# EAGLE schematic M7104B (EAGLE 6.6.0)

## Sheet 1 of 5
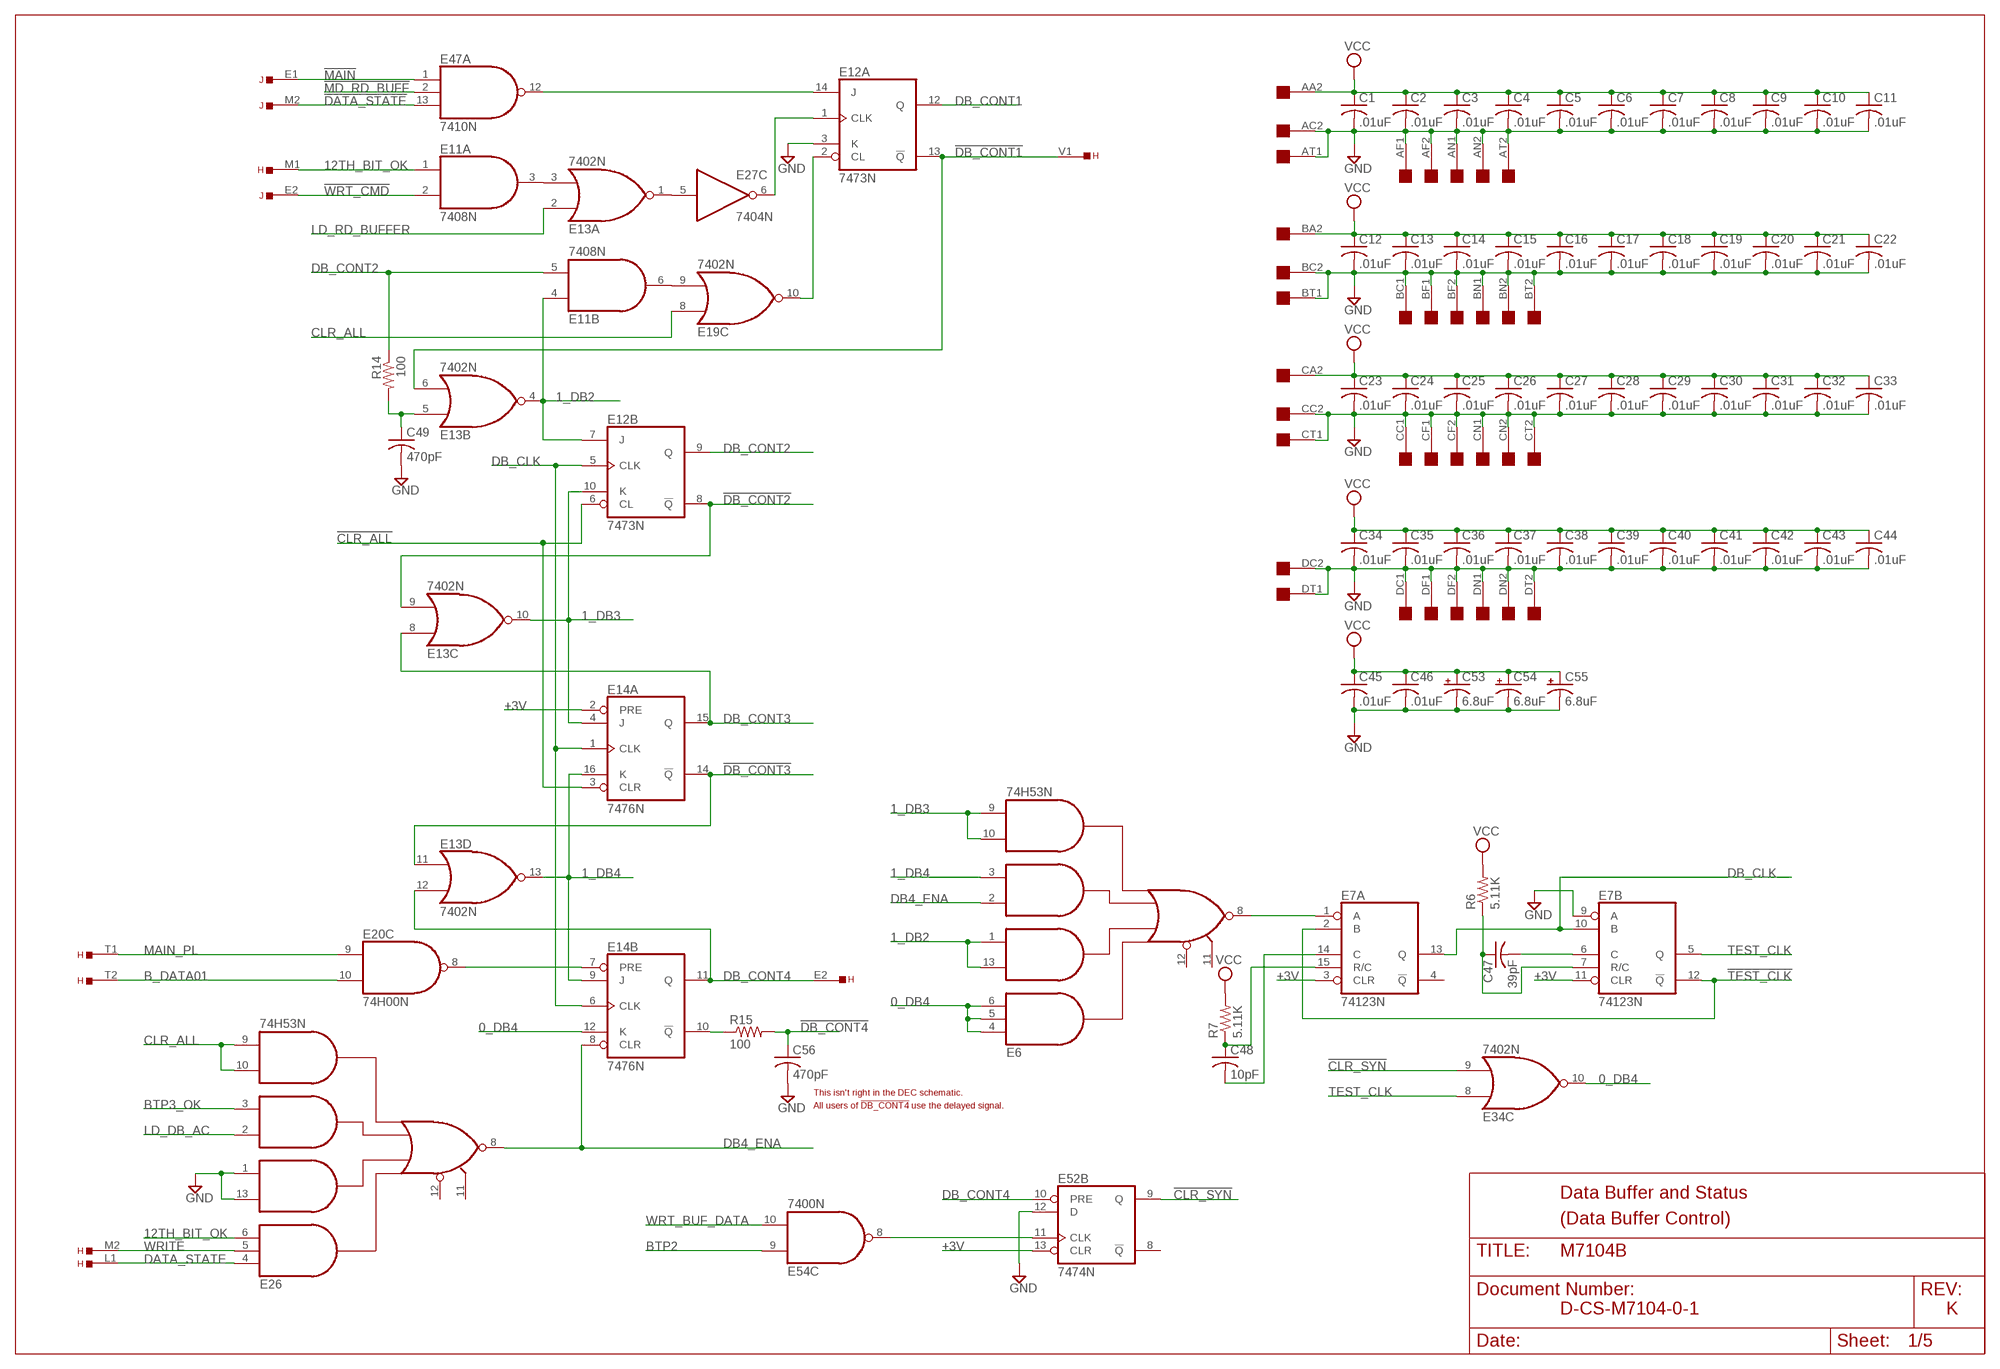
[diagram p0: schematic, sheet 1]

### Parts
C1  .01uF  C-US  [C063-025X075]
C2  .01uF  C-US  [C063-025X075]
C3  .01uF  C-US  [C063-025X075]
C4  .01uF  C-US  [C063-025X075]
C5  .01uF  C-US  [C063-025X075]
C6  .01uF  C-US  [C063-025X075]
C7  .01uF  C-US  [C063-025X075]
C8  .01uF  C-US  [C063-025X075]
C9  .01uF  C-US  [C063-025X075]
C10  .01uF  C-US  [C063-025X075]
C11  .01uF  C-US  [C063-025X075]
C12  .01uF  C-US  [C063-025X075]
C13  .01uF  C-US  [C063-025X075]
C14  .01uF  C-US  [C063-025X075]
C15  .01uF  C-US  [C063-025X075]
C16  .01uF  C-US  [C063-025X075]
C17  .01uF  C-US  [C063-025X075]
C18  .01uF  C-US  [C063-025X075]
C19  .01uF  C-US  [C063-025X075]
C20  .01uF  C-US  [C063-025X075]
C21  .01uF  C-US  [C063-025X075]
C22  .01uF  C-US  [C063-025X075]
C23  .01uF  C-US  [C063-025X075]
C24  .01uF  C-US  [C063-025X075]
C25  .01uF  C-US  [C063-025X075]
C26  .01uF  C-US  [C063-025X075]
C27  .01uF  C-US  [C063-025X075]
C28  .01uF  C-US  [C063-025X075]
C29  .01uF  C-US  [C063-025X075]
C30  .01uF  C-US  [C063-025X075]
C31  .01uF  C-US  [C063-025X075]
C32  .01uF  C-US  [C063-025X075]
C33  .01uF  C-US  [C063-025X075]
C34  .01uF  C-US  [C063-025X075]
C35  .01uF  C-US  [C063-025X075]
C36  .01uF  C-US  [C063-025X075]
C37  .01uF  C-US  [C063-025X075]
C38  .01uF  C-US  [C063-025X075]
C39  .01uF  C-US  [C063-025X075]
C40  .01uF  C-US  [C063-025X075]
C41  .01uF  C-US  [C063-025X075]
C42  .01uF  C-US  [C063-025X075]
C43  .01uF  C-US  [C063-025X075]
C44  .01uF  C-US  [C063-025X075]
C45  .01uF  C-US  [C063-025X075]
C46  .01uF  C-US  [C063-025X075]
C47  39pF  C-US  [C063-025X075]
C48  10pF  C-US  [C063-025X075]
C49  470pF  C-US  [C063-025X075]
C53  6.8uF  CPOL-USE20-8AXIAL  [E12-8]
C54  6.8uF  CPOL-USE20-8AXIAL  [E12-8]
C55  6.8uF  CPOL-USE20-8AXIAL  [E12-8]
C56  470pF  C-US  [C063-025X075]
E6  74H53N  [DIL14]
E7  74123N  [DIL16]
E11  7408N  74S08N  [DIL14]
E12  7473N  74LS73N  [DIL14]
E13  7402N  [DIL14]
E14  7476N  [DIL16]
E19  7402N  [DIL14]
E20  74H00N  74S00N  [DIL14]
E26  74H53N  [DIL14]
E27  7404N  [DIL14]
E34  7402N  [DIL14]
E47  7410N  [DIL14]
E52  7474N  74S74N  [DIL14]
E54  7400N  [DIL14]
H  EDGE-TOP  [EDGE-CON2]
J  EDGE-TOP  [EDGE-CON2]
OMNIBUS  QUAD  [EDGE-CON8]
R6  5.11K  R-US_0207/15  [0207/15]
R7  5.11K  R-US_0207/15  [0207/15]
R14  100  R-US_0207/10  [0207/10]
R15  100  R-US_0207/10  [0207/10]

### Nets
0_DB4: E6.4(I1) E6.5(I11) E6.6(I2) E14.12(B:K) E34.10(C:O)
1_DB2: E6.1(I4) E6.13(I3) E11.4(B:I0) E12.7(B:J) E13.4(B:O)
1_DB3: E6.9(I8) E6.10(I7) E12.10(B:K) E13.10(C:O) E14.4(A:J)
1_DB4: E6.3(I6) E13.13(D:O) E14.9(B:J) E14.16(A:K) ; also sheet 2
12TH_BIT_OK: E11.1(A:I0) E26.6(I2) H.M1
!CLR_ALL: E12.6(B:CL) E14.3(A:CLR) ; also sheet 4
!CLR_SYN: E34.9(C:I1) E52.9(B:Q)
!DATA_STATE: E47.13(A:I2) J.M2
!DB_CONT1: E12.13(A:!Q) E13.6(B:I1) H.V1
!DB_CONT2: E12.8(B:!Q) E13.9(C:I1) ; also sheet 3
!DB_CONT3: E13.11(D:I0) E14.14(A:!Q)
!DB_CONT4: C56.1 R15.2 ; also sheet 2,5
!MAIN: E47.1(A:I0) J.E1 ; also sheet 5
!MD_RD_BUFF: E47.2(A:I1) ; also sheet 2,4
!TEST_CLK: E7.2(A:B) E7.12(B:!Q)
!WRT_CMD: E11.2(A:I1) J.E2 ; also sheet 2,5
+3V: E7.3(A:CLR) E7.11(B:CLR) E14.2(A:PRE) E52.13(B:CLR) ; also sheet 2,3,4,5
B_DATA01: E20.10(C:I1) H.T2
BTP2: E54.9(C:I0) ; also sheet 4
BTP3_OK: E26.3(I6) ; also sheet 4,5
CLR_ALL: E19.8(C:I0) E26.9(I8) E26.10(I7) ; also sheet 3,4,5
DATA_STATE: E26.4(I1) H.L1
DB4_ENA: E6.2(I5) E14.8(B:CLR) E26.8(O)
DB_CLK: E7.10(B:B) E7.13(A:Q) E12.5(B:CLK) E14.1(A:CLK) E14.6(B:CLK) ; also sheet 2
DB_CONT1: E12.12(A:Q) ; also sheet 5
DB_CONT2: E11.5(B:I1) E12.9(B:Q) R14.1 ; also sheet 2
DB_CONT3: E13.8(C:I0) E14.15(A:Q) ; also sheet 2,3
DB_CONT4: E13.12(D:I1) E14.11(B:Q) E52.10(B:PRE) H.E2
GND [supply]: C1.2 C2.2 C3.2 C4.2 C5.2 C6.2 C7.2 C8.2 C9.2 C10.2 C11.2 C12.2 C13.2 C14.2 C15.2 C16.2 C17.2 C18.2 C19.2 C20.2 C21.2 C22.2 C23.2 C24.2 C25.2 C26.2 C27.2 C28.2 C29.2 C30.2 C31.2 C32.2 C33.2 C34.2 C35.2 C36.2 C37.2 C38.2 C39.2 C40.2 C41.2 C42.2 C43.2 C44.2 C45.2 C46.2 C49.2 C53.- C54.- C55.- C56.2 E7.9(B:A) E12.3(A:K) E26.1(I4) E26.13(I3) E52.12(B:D) OMNIBUS.AC2 OMNIBUS.AF1 OMNIBUS.AF2 OMNIBUS.AN1 OMNIBUS.AN2 OMNIBUS.AT1 OMNIBUS.AT2 OMNIBUS.BC1 OMNIBUS.BC2 OMNIBUS.BF1 OMNIBUS.BF2 OMNIBUS.BN1 OMNIBUS.BN2 OMNIBUS.BT1 OMNIBUS.BT2 OMNIBUS.CC1 OMNIBUS.CC2 OMNIBUS.CF1 OMNIBUS.CF2 OMNIBUS.CN1 OMNIBUS.CN2 OMNIBUS.CT1 OMNIBUS.CT2 OMNIBUS.DC1 OMNIBUS.DC2 OMNIBUS.DF1 OMNIBUS.DF2 OMNIBUS.DN1 OMNIBUS.DN2 OMNIBUS.DT1 OMNIBUS.DT2 ; also sheet 3,4,5
LD_DB_AC: E26.2(I5) ; also sheet 4
LD_RD_BUFFER: E13.2(A:I0) ; also sheet 2
MAIN_PL: E20.9(C:I0) H.T1
N$1: E14.10(B:!Q) R15.1
N$7: E12.14(A:J) E47.12(A:O)
N$8: C48.1 E7.15(A:R/C) R7.1
N$13: E11.3(A:O) E13.3(A:I1)
N$14: E13.1(A:O) E27.5(C:I)
N$15: E12.1(A:CLK) E27.6(C:O)
N$16: E11.6(B:O) E19.9(C:I1)
N$17: E12.2(A:CL) E19.10(C:O)
N$19: E52.11(B:CLK) E54.8(C:O)
N$20: C49.1 E13.5(B:I0) R14.2
N$22: E6.8(O) E7.1(A:A)
N$24: C47.1 E7.7(B:R/C) R6.1
N$25: C47.2 E7.6(B:C)
N$27: C48.2 E7.14(A:C)
N$34: E14.7(B:PRE) E20.8(C:O)
TEST_CLK: E7.5(B:Q) E34.8(C:I0)
VCC [supply]: C1.1 C2.1 C3.1 C4.1 C5.1 C6.1 C7.1 C8.1 C9.1 C10.1 C11.1 C12.1 C13.1 C14.1 C15.1 C16.1 C17.1 C18.1 C19.1 C20.1 C21.1 C22.1 C23.1 C24.1 C25.1 C26.1 C27.1 C28.1 C29.1 C30.1 C31.1 C32.1 C33.1 C34.1 C35.1 C36.1 C37.1 C38.1 C39.1 C40.1 C41.1 C42.1 C43.1 C44.1 C45.1 C46.1 C53.+ C54.+ C55.+ OMNIBUS.AA2 OMNIBUS.BA2 OMNIBUS.CA2 R6.2 R7.2 ; also sheet 4,5
WRITE: E26.5(I11) H.M2
WRT_BUF_DATA: E54.10(C:I1) ; also sheet 3
Unconnected: E6.11(I10) E6.12(I9) E7.4(A:!Q) E26.11(I10) E26.12(I9) E52.8(B:!Q) H.F2 H.H2 H.J2 H.K2 J.T2 J.V1 J.V2 OMNIBUS.AA1 OMNIBUS.AB1 OMNIBUS.AB2 OMNIBUS.AC1 OMNIBUS.AD1 OMNIBUS.AD2 OMNIBUS.AE1 OMNIBUS.AE2 OMNIBUS.AH1 OMNIBUS.AH2 OMNIBUS.AJ1 OMNIBUS.AJ2 OMNIBUS.AK2 OMNIBUS.AL2 OMNIBUS.AM2 OMNIBUS.AP2 OMNIBUS.AR2 OMNIBUS.AS2 OMNIBUS.AU2 OMNIBUS.AV2 OMNIBUS.BA1 OMNIBUS.BB1 OMNIBUS.BB2 OMNIBUS.BD1 OMNIBUS.BD2 OMNIBUS.BE1 OMNIBUS.BE2 OMNIBUS.BH1 OMNIBUS.BH2 OMNIBUS.BJ1 OMNIBUS.BJ2 OMNIBUS.BK2 OMNIBUS.BL2 OMNIBUS.BM2 OMNIBUS.BP2 OMNIBUS.BR2 OMNIBUS.BS2 OMNIBUS.BU2 OMNIBUS.CA1 OMNIBUS.CB1 OMNIBUS.CB2 OMNIBUS.CJ1 OMNIBUS.CJ2 OMNIBUS.CK1 OMNIBUS.CK2 OMNIBUS.CL2 OMNIBUS.CM1 OMNIBUS.CP2 OMNIBUS.CR2 OMNIBUS.CS2 OMNIBUS.CU1 OMNIBUS.CU2 OMNIBUS.CV1 OMNIBUS.CV2 OMNIBUS.DA1 OMNIBUS.DA2 OMNIBUS.DB1 OMNIBUS.DB2 OMNIBUS.DD1 OMNIBUS.DD2 OMNIBUS.DE1 OMNIBUS.DE2 OMNIBUS.DH1 OMNIBUS.DH2 OMNIBUS.DJ1 OMNIBUS.DJ2 OMNIBUS.DK2 OMNIBUS.DL2 OMNIBUS.DM2 OMNIBUS.DP2 OMNIBUS.DR2 OMNIBUS.DS2 OMNIBUS.DU2 OMNIBUS.DV2

### Notes on the sheet
- This isn't right in the DEC schematic.
- All users of !DB_CONT4! use the delayed signal.
- Data Buffer and Status
- (Data Buffer Control)
- D-CS-M7104-0-1 | K

## Sheet 2 of 5
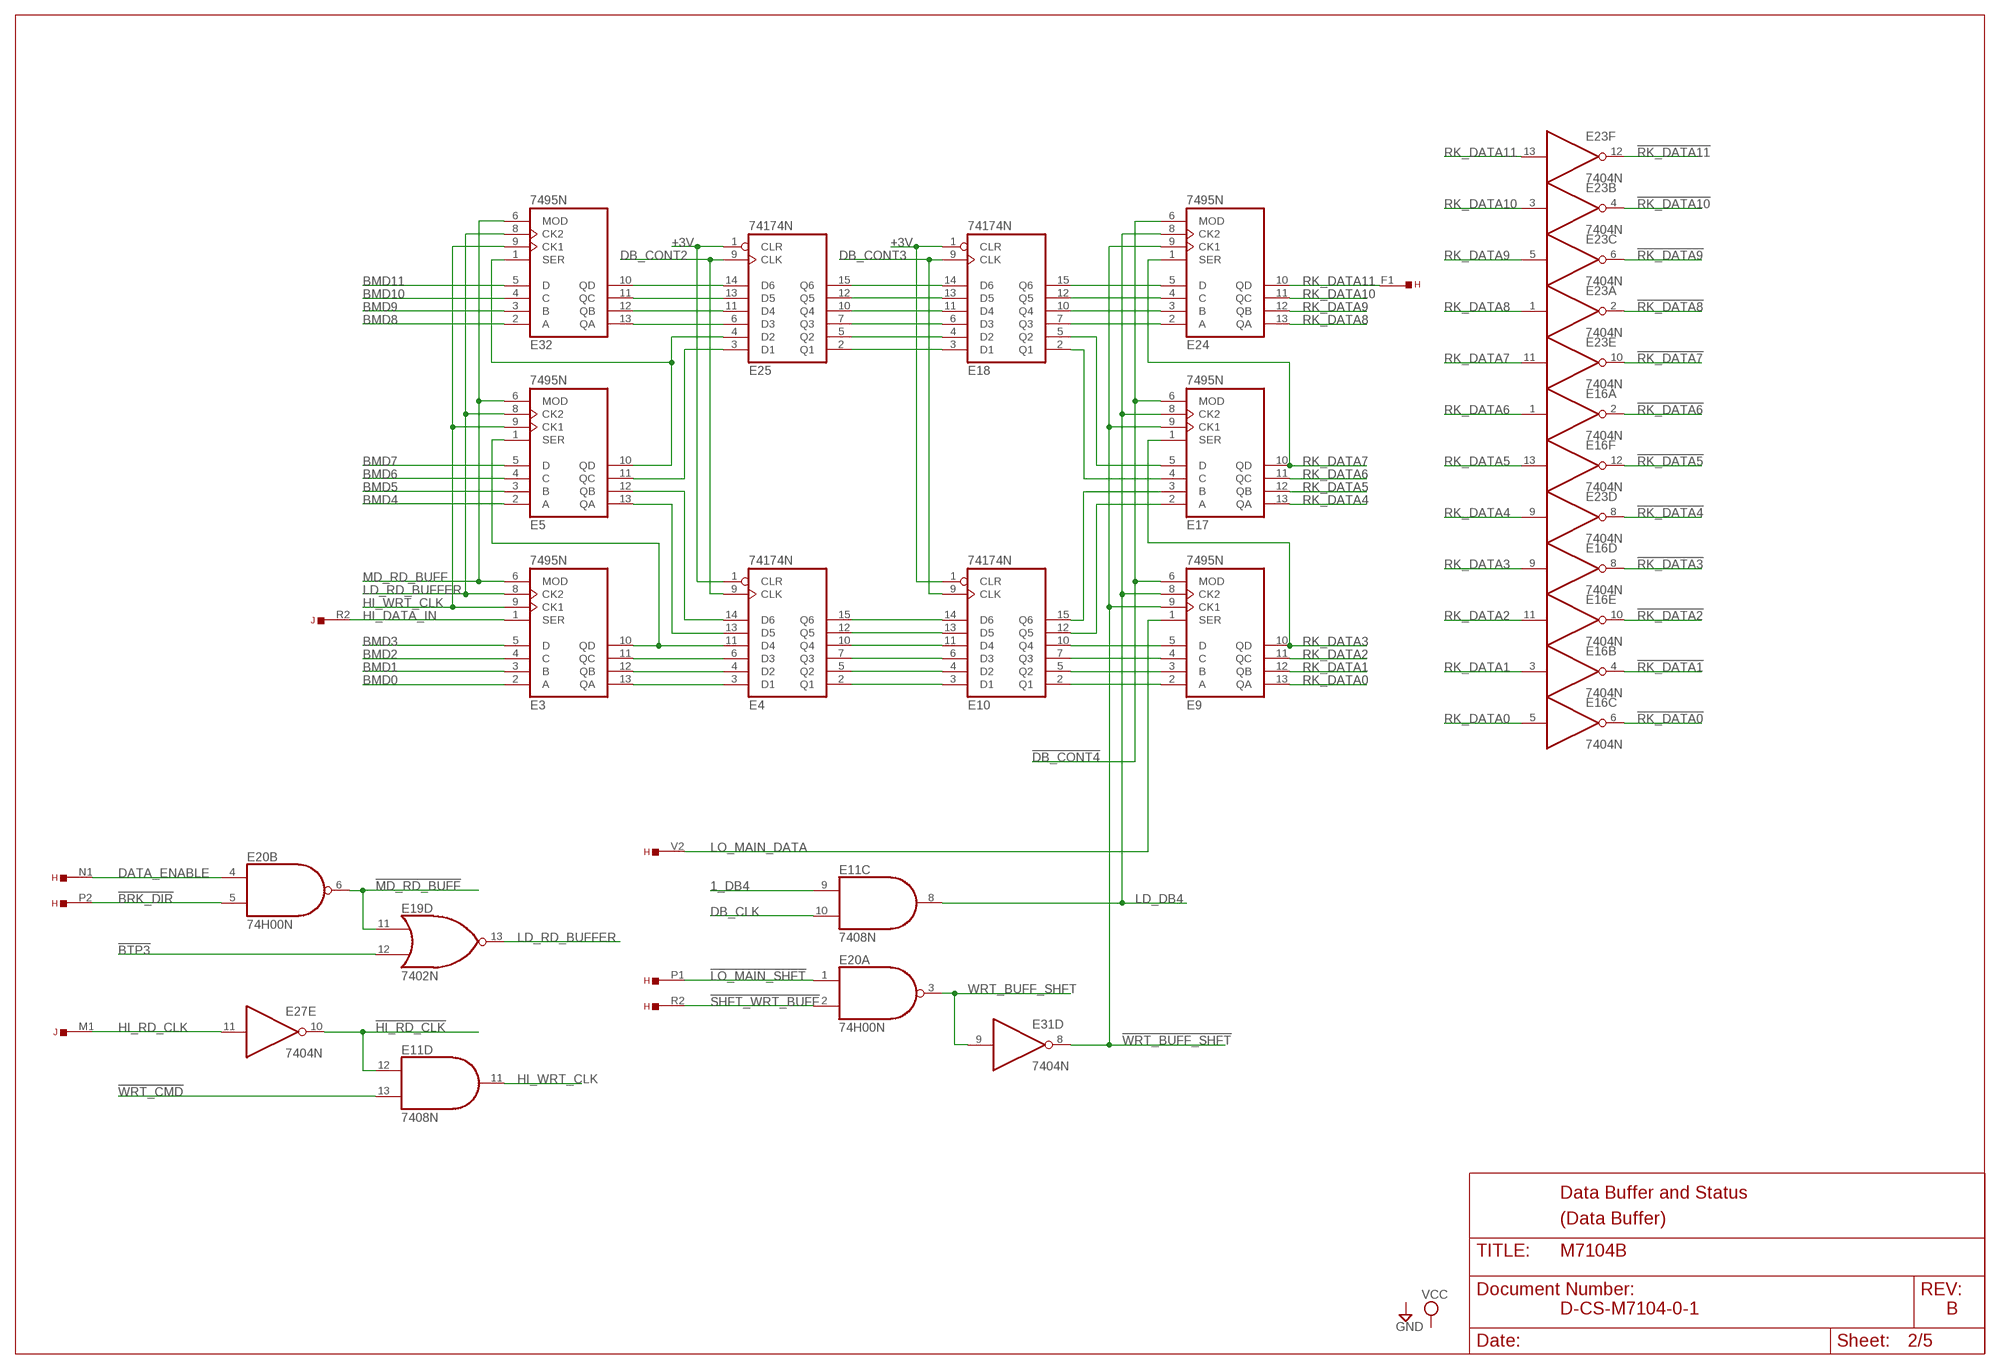
[diagram p1: schematic, sheet 2]

### Parts
E3  7495N  [DIL14]
E4  74174N  [DIL16]
E5  7495N  [DIL14]
E9  7495N  [DIL14]
E10  74174N  [DIL16]
E16  7404N  [DIL14]
E17  7495N  [DIL14]
E18  74174N  [DIL16]
E23  7404N  [DIL14]
E24  7495N  [DIL14]
E25  74174N  [DIL16]
E31  7404N  [DIL14]
E32  7495N  [DIL14]

### Nets
1_DB4: E11.9(C:I0) ; also sheet 1
!BRK_DIR: E20.5(B:I1) H.P2
!BTP3: E19.12(D:I1) ; also sheet 4
!DB_CONT4: E9.6(MOD) E17.6(MOD) E24.6(MOD) ; also sheet 1,5
!HI_RD_CLK: E11.12(D:I0) E27.10(E:O)
!LO_MAIN_SHFT: E20.1(A:I0) H.P1
!MD_RD_BUFF: E19.11(D:I0) E20.6(B:O) ; also sheet 1,4
!RK_DATA0: E16.6(C:O) ; also sheet 3
!RK_DATA1: E16.4(B:O) ; also sheet 3
!RK_DATA2: E16.10(E:O) ; also sheet 3
!RK_DATA3: E16.8(D:O) ; also sheet 3
!RK_DATA4: E23.8(D:O) ; also sheet 3
!RK_DATA5: E16.12(F:O) ; also sheet 3
!RK_DATA6: E16.2(A:O) ; also sheet 3
!RK_DATA7: E23.10(E:O) ; also sheet 3
!RK_DATA8: E23.2(A:O) ; also sheet 3
!RK_DATA9: E23.6(C:O) ; also sheet 3
!RK_DATA10: E23.4(B:O) ; also sheet 3
!RK_DATA11: E23.12(F:O) ; also sheet 3
!SHFT_WRT_BUFF: E20.2(A:I1) H.R2
!WRT_BUFF_SHFT: E9.9(CK1) E17.9(CK1) E24.9(CK1) E31.8(D:O)
!WRT_CMD: E11.13(D:I1) ; also sheet 1,5
+3V: E4.1(CLR) E10.1(CLR) E18.1(CLR) E25.1(CLR) ; also sheet 1,3,4,5
BMD0: E3.2(A) ; also sheet 4
BMD1: E3.3(B) ; also sheet 4
BMD2: E3.4(C) ; also sheet 4
BMD3: E3.5(D) ; also sheet 4
BMD4: E5.2(A) ; also sheet 4
BMD5: E5.3(B) ; also sheet 4
BMD6: E5.4(C) ; also sheet 4
BMD7: E5.5(D) ; also sheet 4
BMD8: E32.2(A) ; also sheet 4
BMD9: E32.3(B) ; also sheet 4
BMD10: E32.4(C) ; also sheet 4
BMD11: E32.5(D) ; also sheet 4
DATA_ENABLE: E20.4(B:I0) H.N1
DB_CLK: E11.10(C:I1) ; also sheet 1
DB_CONT2: E4.9(CLK) E25.9(CLK) ; also sheet 1
DB_CONT3: E10.9(CLK) E18.9(CLK) ; also sheet 1,3
HI_DATA_IN: E3.1(SER) J.R2
HI_RD_CLK: E27.11(E:I) J.M1 ; also sheet 5
HI_WRT_CLK: E3.9(CK1) E5.9(CK1) E11.11(D:O) E32.9(CK1)
LD_DB4: E9.8(CK2) E11.8(C:O) E17.8(CK2) E24.8(CK2)
LD_RD_BUFFER: E3.8(CK2) E5.8(CK2) E19.13(D:O) E32.8(CK2) ; also sheet 1
LO_MAIN_DATA: E9.1(SER) H.V2
MD_RD_BUFF: E3.6(MOD) E5.6(MOD) E32.6(MOD) ; also sheet 4
N$18: E3.13(QA) E4.3(D1)
N$23: E3.12(QB) E4.4(D2)
N$26: E3.11(QC) E4.6(D3)
N$28: E3.10(QD) E4.11(D4) E5.1(SER)
N$30: E25.13(D5) E32.11(QC)
N$31: E25.11(D4) E32.12(QB)
N$32: E25.6(D3) E32.13(QA)
N$36: E17.4(C) E18.2(Q1)
N$37: E5.11(QC) E25.3(D1)
N$38: E5.10(QD) E25.4(D2) E32.1(SER)
N$39: E17.5(D) E18.5(Q2)
N$40: E10.15(Q6) E17.3(B)
N$44: E18.7(Q3) E24.2(A)
N$45: E4.2(Q1) E10.3(D1)
N$46: E4.5(Q2) E10.4(D2)
N$47: E4.7(Q3) E10.6(D3)
N$48: E4.10(Q4) E10.11(D4)
N$49: E4.12(Q5) E10.13(D5)
N$50: E4.15(Q6) E10.14(D6)
N$51: E18.3(D1) E25.2(Q1)
N$52: E18.4(D2) E25.5(Q2)
N$53: E18.6(D3) E25.7(Q3)
N$54: E18.11(D4) E25.10(Q4)
N$55: E18.13(D5) E25.12(Q5)
N$56: E18.14(D6) E25.15(Q6)
N$57: E18.10(Q4) E24.3(B)
N$58: E18.12(Q5) E24.4(C)
N$59: E18.15(Q6) E24.5(D)
N$60: E10.12(Q5) E17.2(A)
N$61: E9.5(D) E10.10(Q4)
N$62: E4.14(D6) E5.12(QB)
N$63: E4.13(D5) E5.13(QA)
N$64: E25.14(D6) E32.10(QD)
N$65: E9.4(C) E10.7(Q3)
N$66: E9.3(B) E10.5(Q2)
N$67: E9.2(A) E10.2(Q1)
RK_DATA0: E9.13(QA) E16.5(C:I)
RK_DATA1: E9.12(QB) E16.3(B:I)
RK_DATA2: E9.11(QC) E16.11(E:I)
RK_DATA3: E9.10(QD) E16.9(D:I) E17.1(SER)
RK_DATA4: E17.13(QA) E23.9(D:I)
RK_DATA5: E16.13(F:I) E17.12(QB)
RK_DATA6: E16.1(A:I) E17.11(QC)
RK_DATA7: E17.10(QD) E23.11(E:I) E24.1(SER)
RK_DATA8: E23.1(A:I) E24.13(QA)
RK_DATA9: E23.5(C:I) E24.12(QB)
RK_DATA10: E23.3(B:I) E24.11(QC)
RK_DATA11: E23.13(F:I) E24.10(QD) H.F1
WRT_BUFF_SHFT: E20.3(A:O) E31.9(D:I)

### Notes on the sheet
- Data Buffer and Status
- (Data Buffer)
- D-CS-M7104-0-1 | B

## Sheet 3 of 5
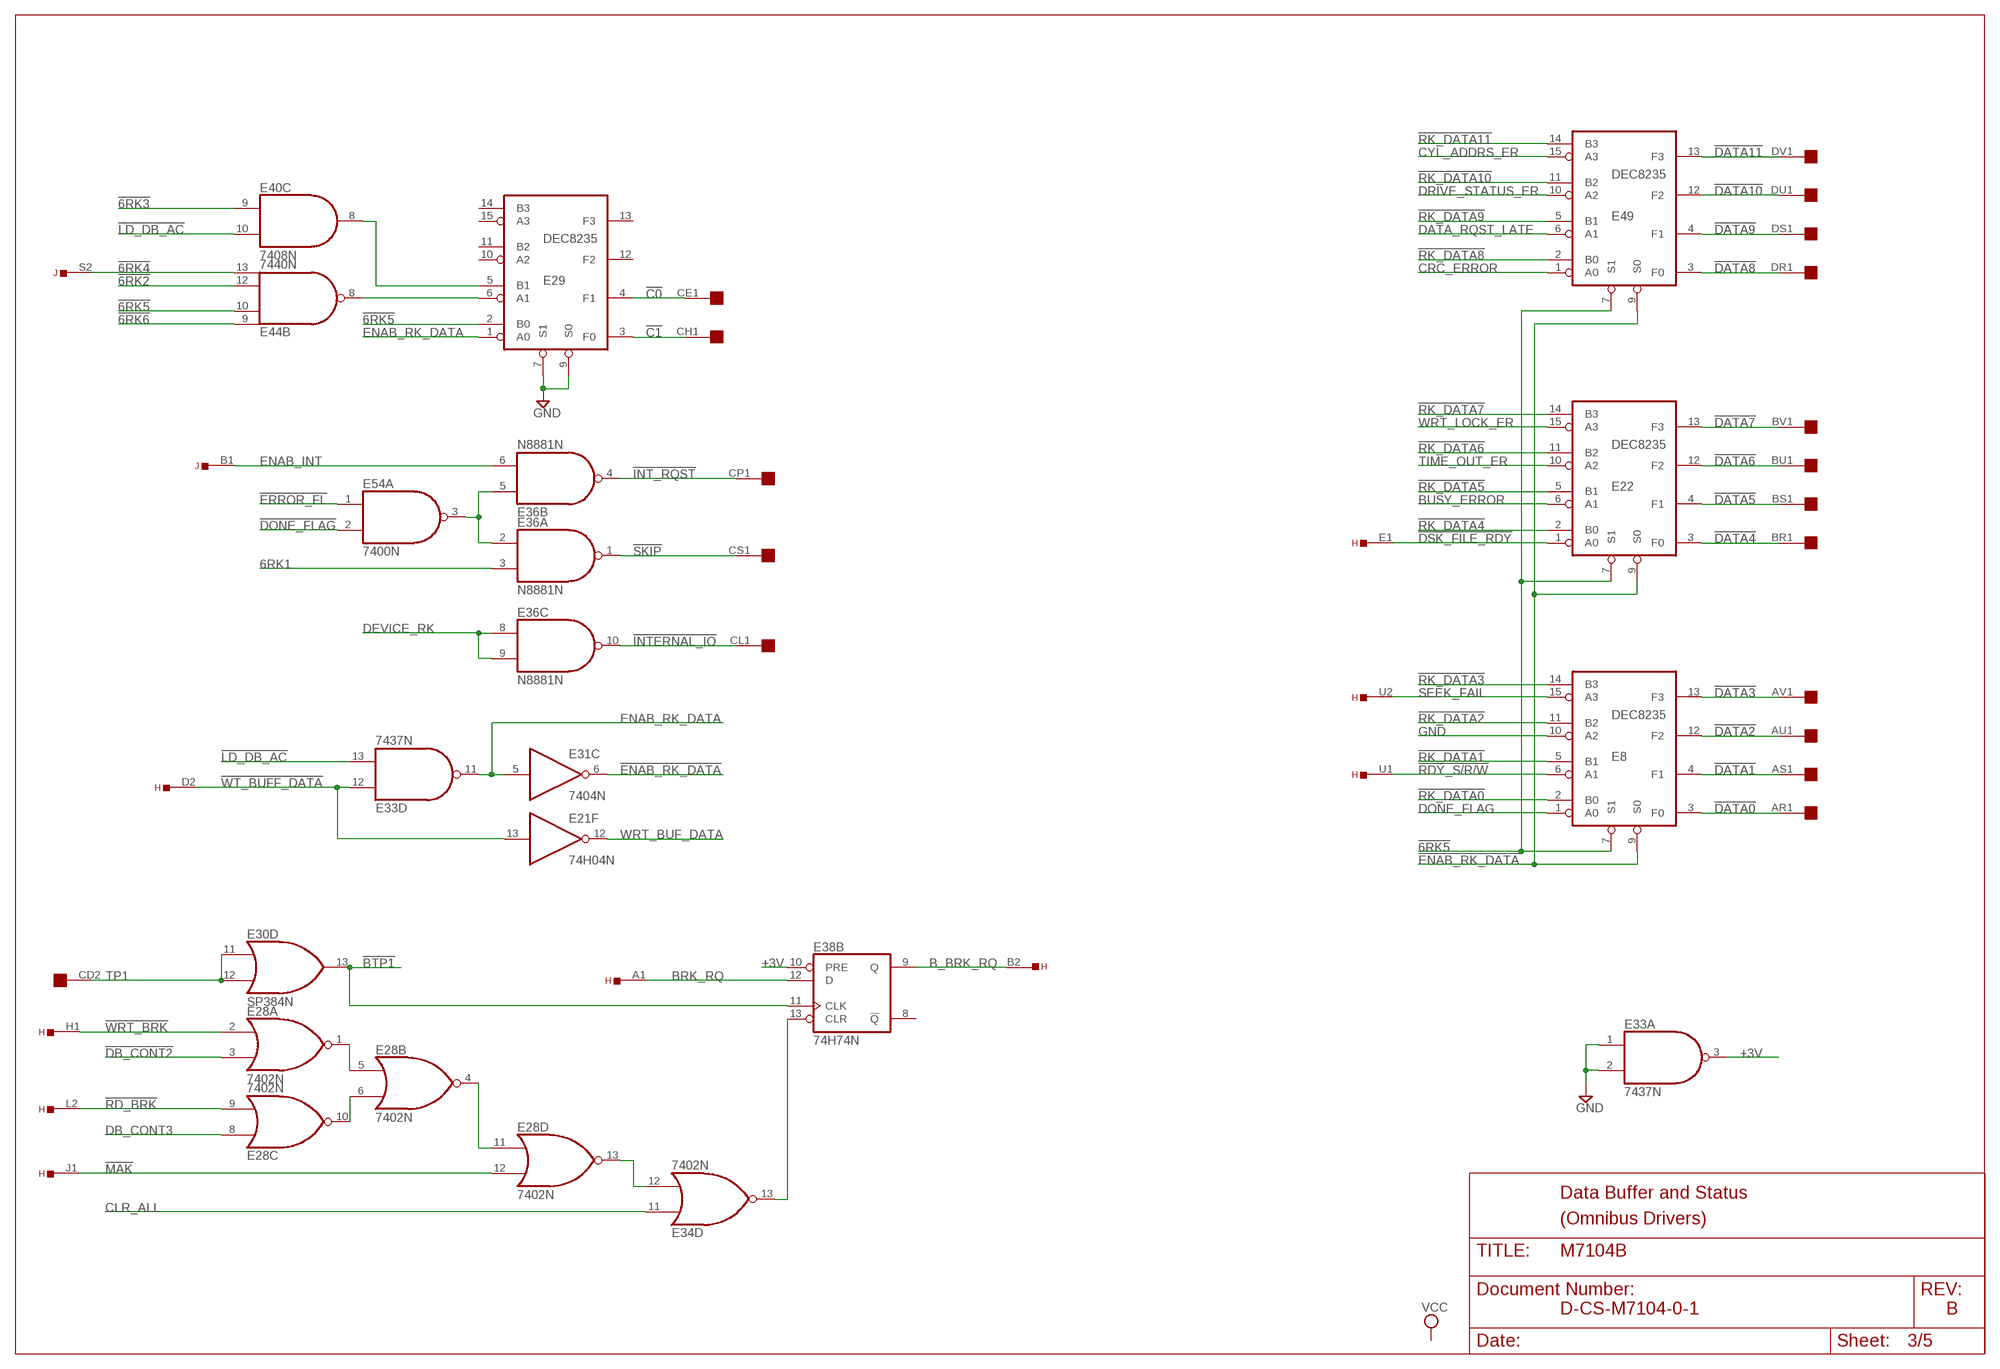
[diagram p2: schematic, sheet 3]

### Parts
E8  DEC8235  [DIL16]
E21  74H04N  7404N  [DIL14]
E22  DEC8235  [DIL16]
E28  7402N  [DIL14]
E29  DEC8235  [DIL16]
E30  SP384N  [DIL14]
E33  7437N  [DIL14]
E36  N8881N  [DIL14]
E38  74H74N  74S74N  [DIL14]
E40  7408N  74S08N  [DIL14]
E44  7440N  [DIL14]
E49  DEC8235  [DIL16]

### Nets
6RK1: E36.3(A:I1) ; also sheet 4
!6RK2: E44.12(B:I2) ; also sheet 4,5
!6RK3: E40.9(C:I0) ; also sheet 4,5
!6RK4: E44.13(B:I3) J.S2 ; also sheet 4,5
!6RK5: E8.7(S1) E22.7(S1) E29.2(B0) E44.10(B:I1) E49.7(S1) ; also sheet 4
!6RK6: E44.9(B:I0) ; also sheet 4,5
!BTP1: E30.13(D:O) E38.11(B:CLK)
!C0: E29.4(F1) OMNIBUS.CE1
!C1: E29.3(F0) OMNIBUS.CH1
!DATA0: E8.3(F0) OMNIBUS.AR1
!DATA1: E8.4(F1) OMNIBUS.AS1
!DATA2: E8.12(F2) OMNIBUS.AU1
!DATA3: E8.13(F3) OMNIBUS.AV1
!DATA4: E22.3(F0) OMNIBUS.BR1
!DATA5: E22.4(F1) OMNIBUS.BS1
!DATA6: E22.12(F2) OMNIBUS.BU1
!DATA7: E22.13(F3) OMNIBUS.BV1 ; also sheet 4
!DATA8: E49.3(F0) OMNIBUS.DR1
!DATA9: E49.4(F1) OMNIBUS.DS1
!DATA10: E49.12(F2) OMNIBUS.DU1
!DATA11: E49.13(F3) OMNIBUS.DV1
!DB_CONT2: E28.3(A:I1) ; also sheet 1
!DONE_FLAG: E54.2(A:I1) ; also sheet 5
!DSK_FILE_RDY: E22.1(A0) H.E1
!ENAB_RK_DATA: E8.9(S0) E22.9(S0) E31.6(C:O) E49.9(S0)
!ERROR_FL: E54.1(A:I0) ; also sheet 5
!INT_RQST: E36.4(B:O) OMNIBUS.CP1
!INTERNAL_IO: E36.10(C:O) OMNIBUS.CL1
!LD_DB_AC: E33.13(D:I1) E40.10(C:I1) ; also sheet 4
!MAK: E28.12(D:I1) H.J1
!RD_BRK: E28.9(C:I1) H.L2
!RDY_S/R/W: E8.6(A1) H.U1
!RK_DATA0: E8.2(B0) ; also sheet 2
!RK_DATA1: E8.5(B1) ; also sheet 2
!RK_DATA2: E8.11(B2) ; also sheet 2
!RK_DATA3: E8.14(B3) ; also sheet 2
!RK_DATA4: E22.2(B0) ; also sheet 2
!RK_DATA5: E22.5(B1) ; also sheet 2
!RK_DATA6: E22.11(B2) ; also sheet 2
!RK_DATA7: E22.14(B3) ; also sheet 2
!RK_DATA8: E49.2(B0) ; also sheet 2
!RK_DATA9: E49.5(B1) ; also sheet 2
!RK_DATA10: E49.11(B2) ; also sheet 2
!RK_DATA11: E49.14(B3) ; also sheet 2
!SKIP: E36.1(A:O) OMNIBUS.CS1
!WRT_BRK: E28.2(A:I0) H.H1
!WT_BUFF_DATA: E21.13(F:I) E33.12(D:I0) H.D2
+3V: E33.3(A:O) E38.10(B:PRE) ; also sheet 1,2,4,5
B_BRK_RQ: E38.9(B:Q) H.B2
BRK_RQ: E38.12(B:D) H.A1
BUSY_ERROR: E22.6(A1) ; also sheet 5
CLR_ALL: E34.11(D:I0) ; also sheet 1,4,5
CRC_ERROR: E49.1(A0) ; also sheet 5
CYL_ADDRS_ER: E49.15(A3) ; also sheet 5
DATA_RQST_LATE: E49.6(A1) ; also sheet 5
DB_CONT3: E28.8(C:I0) ; also sheet 1,2
DEVICE_RK: E36.8(C:I0) E36.9(C:I1) ; also sheet 4
DONE_FLAG: E8.1(A0) ; also sheet 5
DRIVE_STATUS_ER: E49.10(A2) ; also sheet 5
ENAB_INT: E36.6(B:I1) J.B1
ENAB_RK_DATA: E29.1(A0) E31.5(C:I) E33.11(D:O)
GND [supply]: E8.10(A2) E29.7(S1) E29.9(S0) E33.1(A:I0) E33.2(A:I1) ; also sheet 1,4,5
N$3: E29.6(A1) E44.8(B:O)
N$35: E29.5(B1) E40.8(C:O)
N$41: E36.2(A:I0) E36.5(B:I0) E54.3(A:O)
N$42: E28.1(A:O) E28.5(B:I0)
N$43: E28.6(B:I1) E28.10(C:O)
N$68: E28.4(B:O) E28.11(D:I0)
N$70: E34.13(D:O) E38.13(B:CLR)
N$72: E28.13(D:O) E34.12(D:I1)
SEEK_FAIL: E8.15(A3) H.U2
TIME_OUT_ER: E22.10(A2) ; also sheet 5
TP1: E30.11(D:I0) E30.12(D:I1) OMNIBUS.CD2
WRT_BUF_DATA: E21.12(F:O) ; also sheet 1
WRT_LOCK_ER: E22.15(A3) ; also sheet 5
Unconnected: E29.10(A2) E29.11(B2) E29.12(F2) E29.13(F3) E29.14(B3) E29.15(A3) E36.11(D:I0) E36.12(D:I1) E36.13(D:O) E38.8(B:!Q) E44.3(3:NC) E44.11(11:NC)

### Notes on the sheet
- Data Buffer and Status
- (Omnibus Drivers)
- D-CS-M7104-0-1 | B

## Sheet 4 of 5
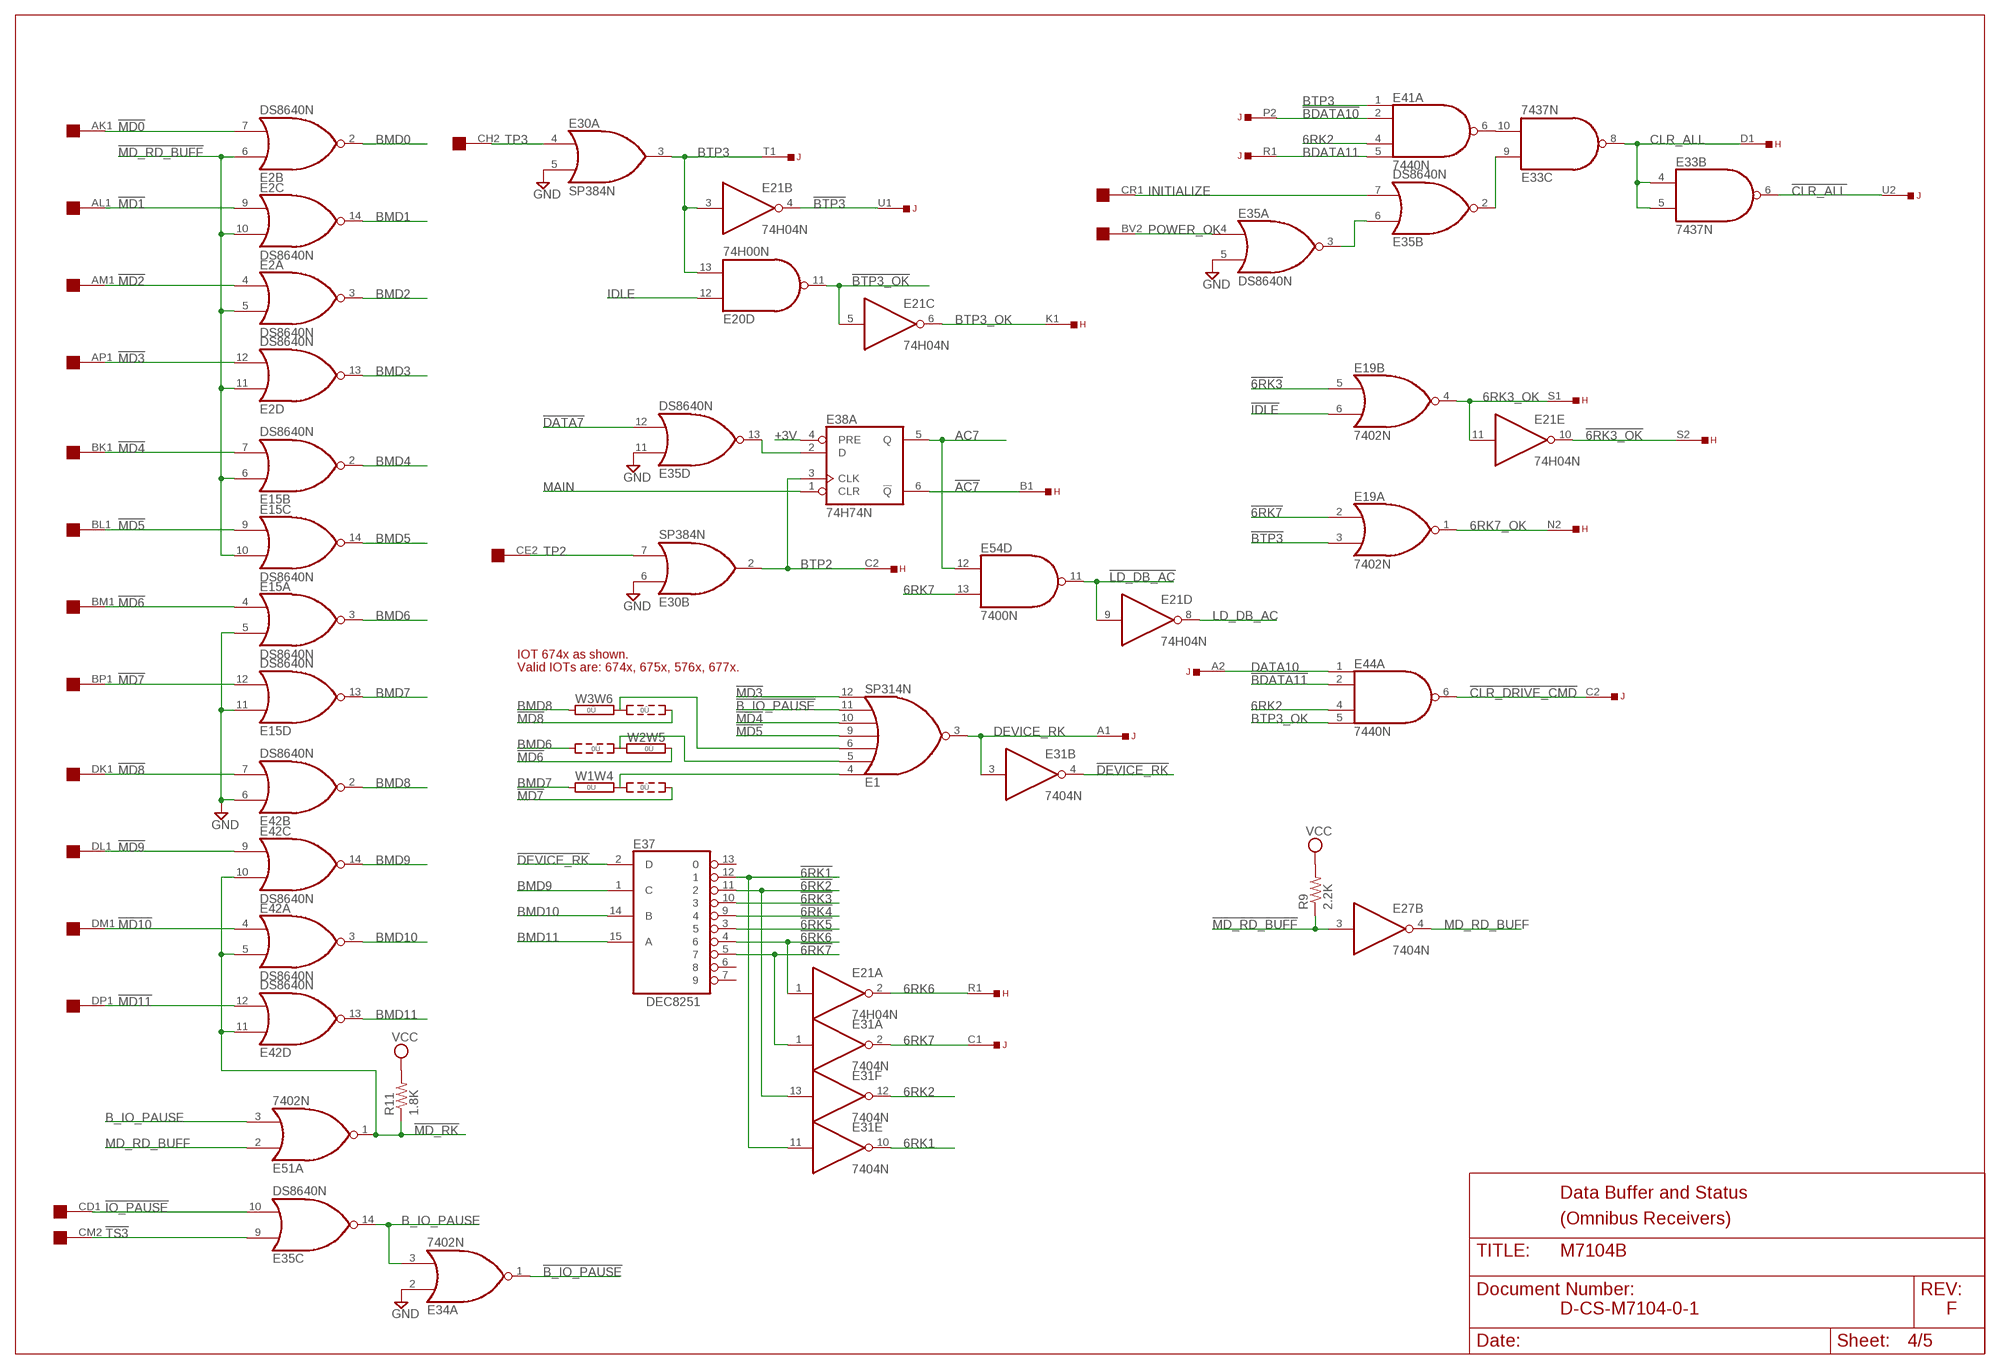
[diagram p3: schematic, sheet 4]

### Parts
E1  SP314N  [DIL14]
E2  DS8640N  [DIL14]
E15  DS8640N  [DIL14]
E35  DS8640N  [DIL14]
E37  DEC8251  [DIL16]
E41  7440N  [DIL14]
E42  DS8640N  [DIL14]
E51  7402N  [DIL14]
R9  2.2K  R-US_0207/10  [0207/10]
R11  1.8K  R-US_0207/10  [0207/10]
W1W4  0R2  [0R2/10]
W2W5  0R2  [0R2/10]
W3W6  0R2  [0R2/10]

### Nets
6RK1: E31.10(E:O) ; also sheet 3
6RK2: E31.12(F:O) E41.4(A:I2) E44.4(A:I2) ; also sheet 5
6RK3_OK: E19.4(B:O) E21.11(E:I) H.S1
6RK6: E21.2(A:O) H.R1
6RK7: E31.2(A:O) E54.13(D:I1) J.C1
6RK7_OK: E19.1(A:O) H.N2
!6RK1: E31.11(E:I) E37.12
!6RK2: E31.13(F:I) E37.11 ; also sheet 3,5
!6RK3: E19.5(B:I0) E37.10 ; also sheet 3,5
!6RK3_OK: E21.10(E:O) H.S2
!6RK4: E37.9 ; also sheet 3,5
!6RK5: E37.3 ; also sheet 3
!6RK6: E21.1(A:I) E37.4 ; also sheet 3,5
!6RK7: E19.2(A:I0) E31.1(A:I) E37.5
!AC7: E38.6(A:!Q) H.B1
!B_IO_PAUSE: E1.11(I5) E34.1(A:O)
!BDATA10: E41.2(A:I1) J.P2
!BDATA11: E44.2(A:I1) ; also sheet 5
!BTP3: E19.3(A:I1) E21.4(B:O) J.U1 ; also sheet 2
!BTP3_OK: E20.11(D:O) E21.5(C:I)
!CLR_ALL: E33.6(B:O) J.U2 ; also sheet 1
!CLR_DRIVE_CMD: E44.6(A:O) J.C2 ; also sheet 5
!DATA7: E35.12(D:I1) ; also sheet 3
!DEVICE_RK: E31.4(B:O) E37.2(D)
!IDLE: E19.6(B:I1) ; also sheet 5
!IO_PAUSE: E35.10(C:I1) OMNIBUS.CD1
!LD_DB_AC: E21.9(D:I) E54.11(D:O) ; also sheet 3
!MD0: E2.7(B:I1) OMNIBUS.AK1
!MD1: E2.9(C:I0) OMNIBUS.AL1
!MD2: E2.4(A:I0) OMNIBUS.AM1
!MD3: E1.12(I6) E2.12(D:I1) OMNIBUS.AP1
!MD4: E1.10(I4) E15.7(B:I1) OMNIBUS.BK1
!MD5: E1.9(I3) E15.9(C:I0) OMNIBUS.BL1
!MD6: E15.4(A:I0) OMNIBUS.BM1 W2W5.1
!MD7: E15.12(D:I1) OMNIBUS.BP1 W1W4.3
!MD8: E42.7(B:I1) OMNIBUS.DK1 W3W6.3
!MD9: E42.9(C:I0) OMNIBUS.DL1
!MD10: E42.4(A:I0) OMNIBUS.DM1
!MD11: E42.12(D:I1) OMNIBUS.DP1
!MD_RD_BUFF: E2.5(A:I1) E2.6(B:I0) E2.10(C:I1) E2.11(D:I0) E15.6(B:I0) E15.10(C:I1) E27.3(B:I) R9.1 ; also sheet 1,2
!MD_RK: E42.5(A:I1) E42.10(C:I1) E42.11(D:I0) E51.1(A:O) R11.1
!TS3: E35.9(C:I0) OMNIBUS.CM2
+3V: E38.4(A:PRE) ; also sheet 1,2,3,5
AC7: E38.5(A:Q) E54.12(D:I0)
B_IO_PAUSE: E34.3(A:I1) E35.14(C:O) E51.3(A:I1)
BDATA11: E41.5(A:I3) J.R1
BMD0: E2.2(B:O) ; also sheet 2
BMD1: E2.14(C:O) ; also sheet 2
BMD2: E2.3(A:O) ; also sheet 2
BMD3: E2.13(D:O) ; also sheet 2
BMD4: E15.2(B:O) ; also sheet 2
BMD5: E15.14(C:O) ; also sheet 2
BMD6: E15.3(A:O) W2W5.3 ; also sheet 2
BMD7: E15.13(D:O) W1W4.1 ; also sheet 2
BMD8: E42.2(B:O) W3W6.1 ; also sheet 2
BMD9: E37.1(C) E42.14(C:O) ; also sheet 2
BMD10: E37.14(B) E42.3(A:O) ; also sheet 2
BMD11: E37.15(A) E42.13(D:O) ; also sheet 2
BTP2: E30.2(B:O) E38.3(A:CLK) H.C2 ; also sheet 1
BTP3: E20.13(D:I1) E21.3(B:I) E30.3(A:O) E41.1(A:I0) J.T1 ; also sheet 5
BTP3_OK: E21.6(C:O) E44.5(A:I3) H.K1 ; also sheet 1,5
CLR_ALL: E33.4(B:I0) E33.5(B:I1) E33.8(C:O) H.D1 ; also sheet 1,3,5
DATA10: E44.1(A:I0) J.A2
DEVICE_RK: E1.3(O) E31.3(B:I) J.A1 ; also sheet 3
GND [supply]: E15.5(A:I1) E15.11(D:I0) E30.5(A:I1) E30.6(B:I0) E34.2(A:I0) E35.5(A:I1) E35.11(D:I0) E42.6(B:I0) ; also sheet 1,3,5
IDLE: E20.12(D:I0) ; also sheet 5
INITIALIZE: E35.7(B:I1) OMNIBUS.CR1
LD_DB_AC: E21.8(D:O) ; also sheet 1
MAIN: E38.1(A:CLR) ; also sheet 5
MD_RD_BUFF: E27.4(B:O) E51.2(A:I0) ; also sheet 2
N$71: E35.13(D:O) E38.2(A:D)
N$73: E33.10(C:I1) E41.6(A:O)
N$74: E1.4(I0) W1W4.2
N$75: E1.5(I1) W2W5.2
N$76: E1.6(I2) W3W6.2
N$77: E35.3(A:O) E35.6(B:I0)
N$78: E33.9(C:I0) E35.2(B:O)
POWER_OK: E35.4(A:I0) OMNIBUS.BV2
TP2: E30.7(B:I1) OMNIBUS.CE2
TP3: E30.4(A:I0) OMNIBUS.CH2
VCC [supply]: R9.2 R11.2 ; also sheet 1,5
Unconnected: E37.6 E37.7 E37.13 E41.3(3:NC) E41.11(11:NC)

### Notes on the sheet
- IOT 674x as shown.
- Valid IOTs are: 674x, 675x, 576x, 677x.
- Data Buffer and Status
- (Omnibus Receivers)
- D-CS-M7104-0-1 | F

## Sheet 5 of 5
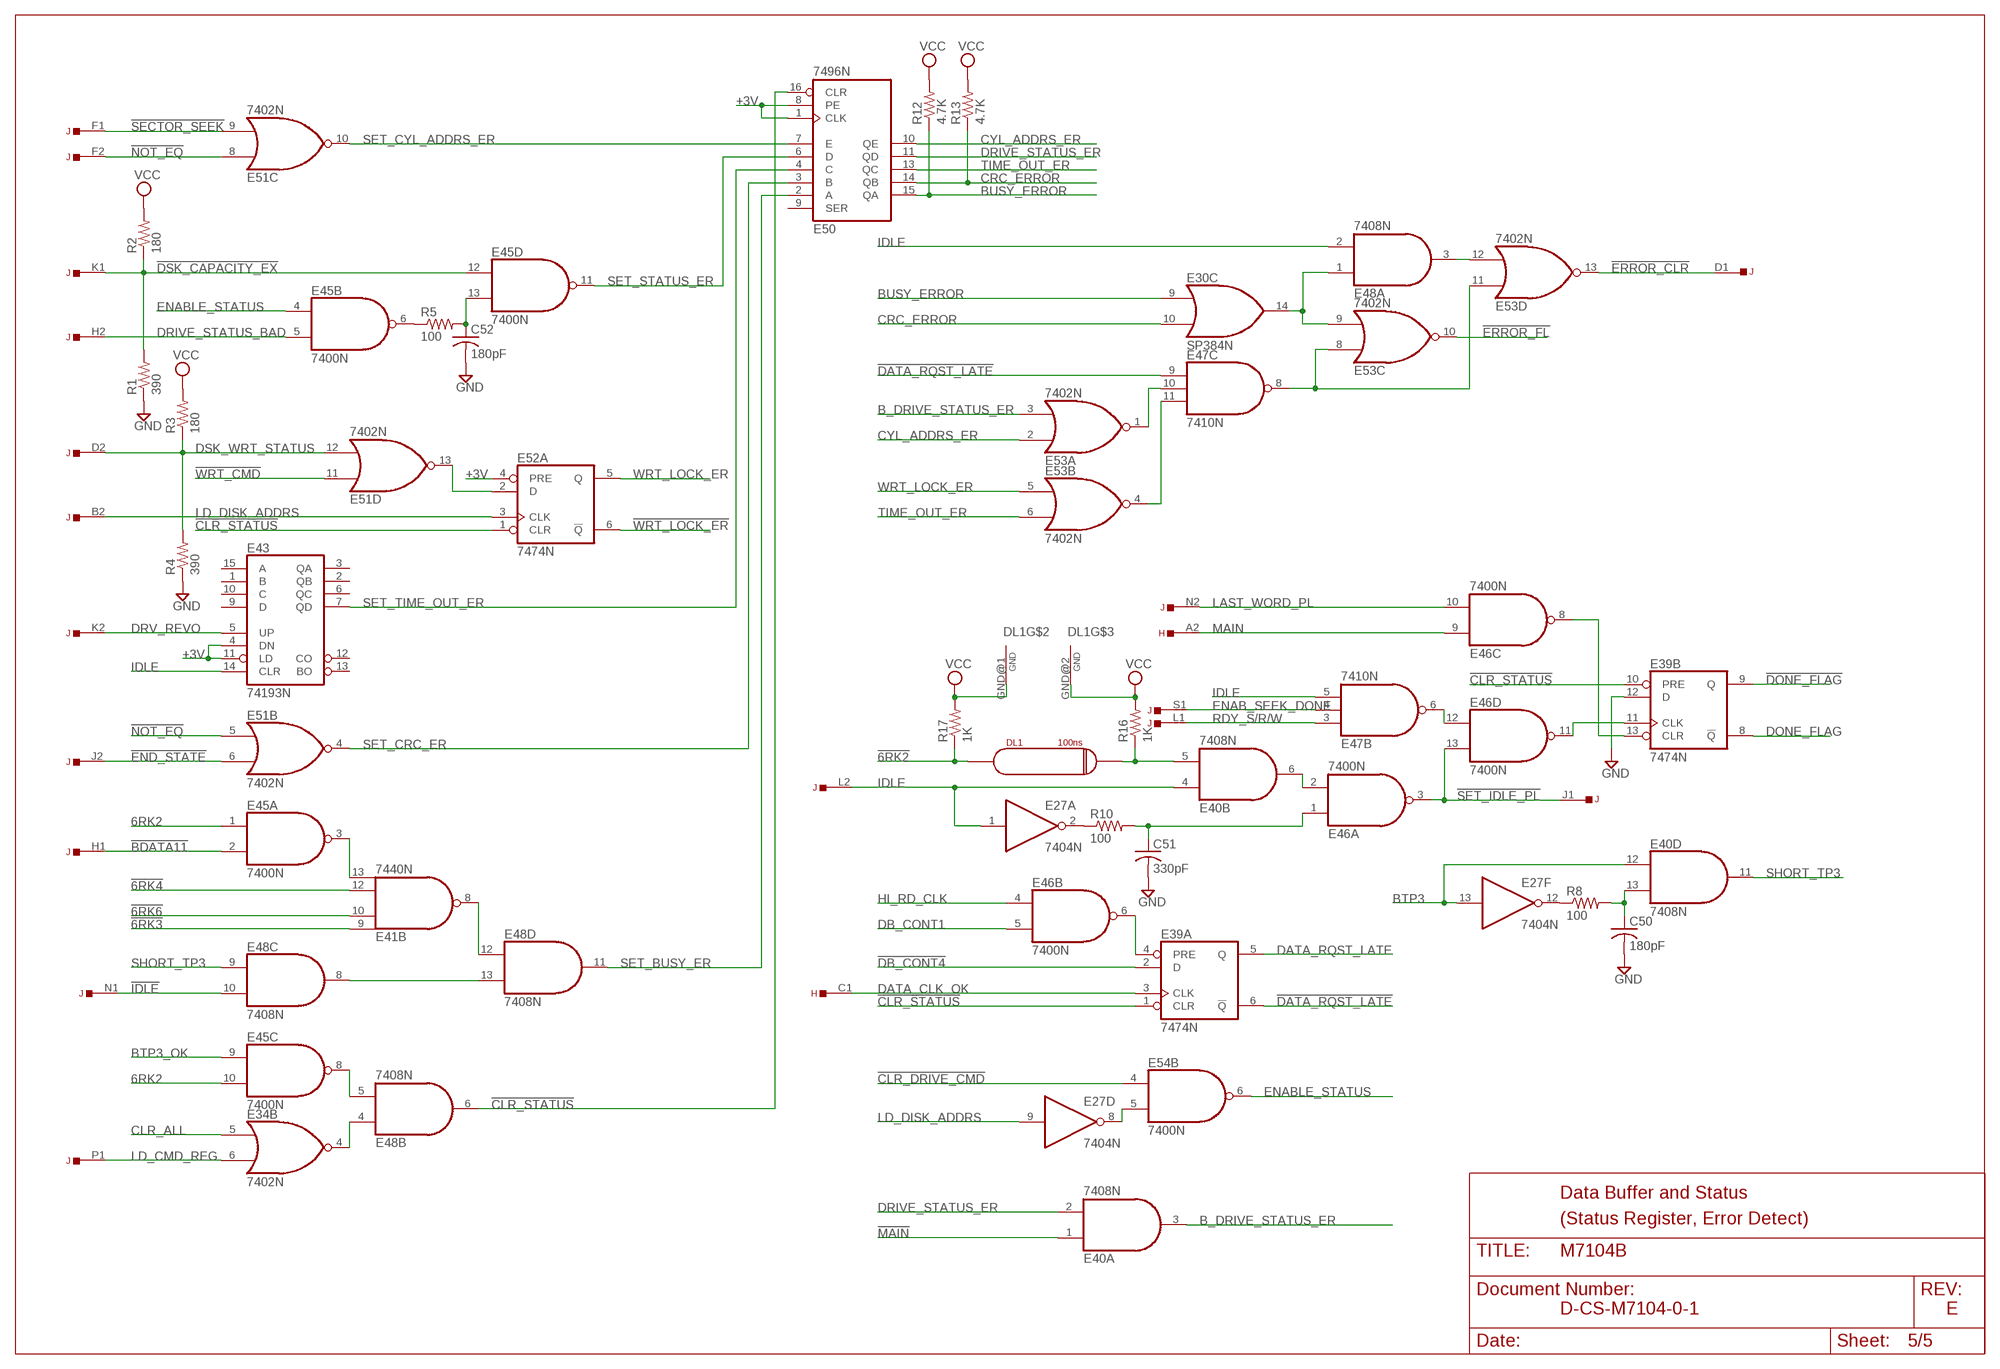
[diagram p4: schematic, sheet 5]

### Parts
C50  180pF  C-US  [C063-025X075]
C51  330pF  C-US  [C063-025X075]
C52  180pF  C-US  [C063-025X075]
DL1  100ns  RC-L-22  [RCL-L-XX-22]
E39  7474N  74S74N  [DIL14]
E43  74193N  [DIL16]
E45  7400N  [DIL14]
E46  7400N  [DIL14]
E48  7408N  74S08N  [DIL14]
E50  7496N  74LS96N  [DIL16]
E53  7402N  [DIL14]
R1  390  R-US_0207/10  [0207/10]
R2  180  R-US_0207/10  [0207/10]
R3  180  R-US_0207/10  [0207/10]
R4  390  R-US_0207/10  [0207/10]
R5  100  R-US_0207/10  [0207/10]
R8  100  R-US_0207/10  [0207/10]
R10  100  R-US_0207/10  [0207/10]
R12  4.7K  R-US_0207/10  [0207/10]
R13  4.7K  R-US_0207/10  [0207/10]
R16  1K  R-US_0207/10  [0207/10]
R17  1K  R-US_0207/10  [0207/10]

### Nets
6RK2: E45.1(A:I0) E45.10(C:I1) ; also sheet 4
!6RK2: DL1.IN R17.1 ; also sheet 3,4
!6RK3: E41.9(B:I0) ; also sheet 3,4
!6RK4: E41.12(B:I2) ; also sheet 3,4
!6RK6: E41.10(B:I1) ; also sheet 3,4
!BDATA11: E45.2(A:I1) J.H1 ; also sheet 4
!CLR_DRIVE_CMD: E54.4(B:I0) ; also sheet 4
!CLR_STATUS: E39.1(A:CLR) E39.10(B:PRE) E48.6(B:O) E50.16(CLR) E52.1(A:CLR)
!DATA_RQST_LATE: E39.6(A:!Q) E47.9(C:I0)
!DB_CONT4: E39.2(A:D) ; also sheet 1,2
!DONE_FLAG: E39.9(B:Q) ; also sheet 3
!DSK_CAPACITY_EX: E45.12(D:I0) J.K1 R1.2 R2.1
!END_STATE: E51.6(B:I1) J.J2
!ERROR_CLR: E53.13(D:O) J.D1
!ERROR_FL: E53.10(C:O) ; also sheet 3
!IDLE: E48.10(C:I1) J.N1 ; also sheet 4
!MAIN: E40.1(A:I0) ; also sheet 1
!NOT_EQ: E51.5(B:I0) E51.8(C:I0) J.F2
!SECTOR_SEEK: E51.9(C:I1) J.F1
!SET_IDLE_PL: E46.3(A:O) E46.13(D:I1) J.J1
!WRT_CMD: E51.11(D:I0) ; also sheet 1,2
!WRT_LOCK_ER: E52.6(A:!Q)
+3V: E43.4(DN) E43.11(LD) E50.1(CLK) E50.8(PE) E52.4(A:PRE) ; also sheet 1,2,3,4
B_DRIVE_STATUS_ER: E40.3(A:O) E53.3(A:I1)
BTP3: E27.13(F:I) E40.12(D:I0) ; also sheet 4
BTP3_OK: E45.9(C:I0) ; also sheet 1,4
BUSY_ERROR: E30.9(C:I0) E50.15(QA) R12.1 ; also sheet 3
CLR_ALL: E34.5(B:I0) ; also sheet 1,3,4
CRC_ERROR: E30.10(C:I1) E50.14(QB) R13.1 ; also sheet 3
CYL_ADDRS_ER: E50.10(QE) E53.2(A:I0) ; also sheet 3
DATA_CLK_OK: E39.3(A:CLK) H.C1
DATA_RQST_LATE: E39.5(A:Q) ; also sheet 3
DB_CONT1: E46.5(B:I1) ; also sheet 1
DONE_FLAG: E39.8(B:!Q) ; also sheet 3
DRIVE_STATUS_BAD: E45.5(B:I1) J.H2
DRIVE_STATUS_ER: E40.2(A:I1) E50.11(QD) ; also sheet 3
DRV_REVO: E43.5(UP) J.K2
DSK_WRT_STATUS: E51.12(D:I1) J.D2 R3.1 R4.2
ENAB_SEEK_DONE: E47.4(B:I1) J.S1
ENABLE_STATUS: E45.4(B:I0) E54.6(B:O)
GND [supply]: C50.2 C51.2 C52.2 E39.12(B:D) R1.1 R4.1 ; also sheet 1,3,4
HI_RD_CLK: E46.4(B:I0) ; also sheet 2
IDLE: E27.1(A:I) E40.4(B:I0) E43.14(CLR) E47.5(B:I2) E48.2(A:I1) J.L2 ; also sheet 4
LAST_WORD_PL: E46.10(C:I1) J.N2
LD_CMD_REG: E34.6(B:I1) J.P1
LD_DISK_ADDRS: E27.9(D:I) E52.3(A:CLK) J.B2
MAIN: E46.9(C:I0) H.A2 ; also sheet 4
N$5: E45.6(B:O) R5.1
N$6: C52.1 E45.13(D:I1) R5.2
N$10: C51.1 E46.1(A:I0) R10.2
N$12: E51.13(D:O) E52.2(A:D)
N$79: E41.13(B:I3) E45.3(A:O)
N$80: E41.8(B:O) E48.12(D:I0)
N$81: E40.6(B:O) E46.2(A:I1)
N$82: DL1.OUT E40.5(B:I1) R16.1
N$83: E48.8(C:O) E48.13(D:I1)
N$84: E45.8(C:O) E48.5(B:I1)
N$85: E34.4(B:O) E48.4(B:I0)
N$86: E47.11(C:I2) E53.4(B:O)
N$87: E47.10(C:I1) E53.1(A:O)
N$88: E30.14(C:O) E48.1(A:I0) E53.9(C:I1)
N$89: E47.8(C:O) E53.8(C:I0) E53.11(D:I0)
N$90: E48.3(A:O) E53.12(D:I1)
N$93: E27.2(A:O) R10.1
N$95: E46.12(D:I0) E47.6(B:O)
N$97: E39.11(B:CLK) E46.11(D:O)
N$98: E39.13(B:CLR) E46.8(C:O)
N$99: E39.4(A:PRE) E46.6(B:O)
N$100: E27.8(D:O) E54.5(B:I1)
N$101: E27.12(F:O) R8.1
N$102: C50.1 E40.13(D:I1) R8.2
RDY_S/R/W: E47.3(B:I0) J.L1
SET_BUSY_ER: E48.11(D:O) E50.2(A)
SET_CRC_ER: E50.3(B) E51.4(B:O)
SET_CYL_ADDRS_ER: E50.7(E) E51.10(C:O)
SET_STATUS_ER: E45.11(D:O) E50.6(D)
SET_TIME_OUT_ER: E43.7(QD) E50.4(C)
SHORT_TP3: E40.11(D:O) E48.9(C:I0)
TIME_OUT_ER: E50.13(QC) E53.6(B:I1) ; also sheet 3
VCC [supply]: DL1.GND@1(GND) DL1.GND@2(GND) R2.2 R3.2 R12.2 R13.2 R16.2 R17.2 ; also sheet 1,4
WRT_LOCK_ER: E52.5(A:Q) E53.5(B:I0) ; also sheet 3
Unconnected: E43.1(B) E43.2(QB) E43.3(QA) E43.6(QC) E43.9(D) E43.10(C) E43.12(CO) E43.13(BO) E43.15(A) E50.9(SER)

### Notes on the sheet
- Data Buffer and Status
- (Status Register, Error Detect)
- D-CS-M7104-0-1 | E

## Power pins joined to a net without a drawn wire
GND: E1.1(GND) E2.1(P:GND) E3.7(GND) E4.8(GND) E5.7(GND) E6.7(GND) E7.8(P:GND) E8.8(GND) E9.7(GND) E10.8(GND) E11.7(P:GND) E12.11(P:GND) E13.7(P:GND) E14.13(P:GND) E15.1(P:GND) E16.7(P:GND) E17.7(GND) E18.8(GND) E19.7(P:GND) E20.7(P:GND) E21.7(P:GND) E22.8(GND) E23.7(P:GND) E24.7(GND) E25.8(GND) E26.7(GND) E27.7(P:GND) E28.7(P:GND) E29.8(GND) E30.1(GND) E31.7(P:GND) E32.7(GND) E33.7(P:GND) E34.7(P:GND) E35.1(P:GND) E36.7(P:GND) E37.8(GND) E38.7(P:GND) E39.7(P:GND) E40.7(P:GND) E41.7(P:GND) E42.1(P:GND) E43.8(GND) E44.7(P:GND) E45.7(P:GND) E46.7(P:GND) E47.7(P:GND) E48.7(P:GND) E49.8(GND) E50.12(GND) E51.7(P:GND) E52.7(P:GND) E53.7(P:GND) E54.7(P:GND)
VCC: E1.8(VCC) E2.8(P:VCC) E3.14(VCC) E4.16(VCC) E5.14(VCC) E6.14(VCC) E7.16(P:VCC) E8.16(VCC) E9.14(VCC) E10.16(VCC) E11.14(P:VCC) E12.4(P:VCC) E13.14(P:VCC) E14.5(P:VCC) E15.8(P:VCC) E16.14(P:VCC) E17.14(VCC) E18.16(VCC) E19.14(P:VCC) E20.14(P:VCC) E21.14(P:VCC) E22.16(VCC) E23.14(P:VCC) E24.14(VCC) E25.16(VCC) E26.14(VCC) E27.14(P:VCC) E28.14(P:VCC) E29.16(VCC) E30.8(VCC) E31.14(P:VCC) E32.14(VCC) E33.14(P:VCC) E34.14(P:VCC) E35.8(P:VCC) E36.14(P:VCC) E37.16(VCC) E38.14(P:VCC) E39.14(P:VCC) E40.14(P:VCC) E41.14(P:VCC) E42.8(P:VCC) E43.16(VCC) E44.14(P:VCC) E45.14(P:VCC) E46.14(P:VCC) E47.14(P:VCC) E48.14(P:VCC) E49.16(VCC) E50.5(VCC) E51.14(P:VCC) E52.14(P:VCC) E53.14(P:VCC) E54.14(P:VCC)

## Library data of the parts
C1-C52 C56 = dec-con:C-US: Capacitor with funky DEC lead spacing.
C53-C55 = dec-con:CPOL-USE20-8AXIAL: A 0.8 inch electrolytic.
DL1 = dec-con:RC-L-22: Delay Line
E1 = dec-con:SP314: 7-Input NOR gate
E2 E15 E35 E42 = dec-con:DS8640: Quad NOR gate
E3 E5 E9 E17 E24 E32 = 74xx-us:74*95: 4-bit parallel access SHIFT REGISTER
E4 E10 E18 E25 = 74xx-us:74*174: Hex D type FLIP FLOP, clear
E6 E26 = dec-con:74H53N: 2-2-2-3 Input And-Or-Invert Gate
E7 = 74xx-us:74*123: Retriggerable monostable MULTIVIBRATOR
E8 E22 E29 E49 = dec-con:DEC8235: 4-bit data selector
E11 E40 E48 = 74xx-us:74*08: Quad 2-input AND gate
E12 = 74xx-us:74*73: Dual J-K FLIP FLOP, clear
E13 E19 E28 E34 E51 E53 = 74xx-us:74*02: Quad 2-input NOR gate
E14 = 74xx-us:74*76: Dual J-K FLIP FLOP, preset and clear
E16 E21 E23 E27 E31 = 74xx-us:74*04: Hex INVERTER
E20 E45 E46 E54 = 74xx-us:74*00: Quad 2-input NAND gate
E30 = dec-con:SP384: Quad OR gate
E33 = 74xx-us:74*37: Quad 2-input NAND buffer
E36 = dec-con:N8881: Quad 2-input NAND gate, open collector
E37 = dec-con:DEC8251: BCD Decoder
E38 E39 E52 = 74xx-us:74*74: Dual D type positive edge triggered FLIP FLOP, preset and clear
E41 E44 = dec-con:74*40: Dual 4-input NAND gate
E43 = dec-con:74*193: Synchronous 4-bit UP/DOWN COUNTER
E47 = 74xx-us:74*10: Triple 3-input NAND gate
E50 = 74xx-us:74*96: 5-bit SHIFT REGISTER
H J = dec-con:EDGE-TOP: Labeled DEC edge connector, suitable for top connector.
OMNIBUS = dec-con:QUAD: Quad-Height DEC board
R1-R17 = rcl:R-US_: RESISTOR, American symbol
W1W4 W2W5 W3W6 = jumper:0R2: Bridge switch 0R 2 x 10mm

## Net classes
1 supply: width 0.813 mm